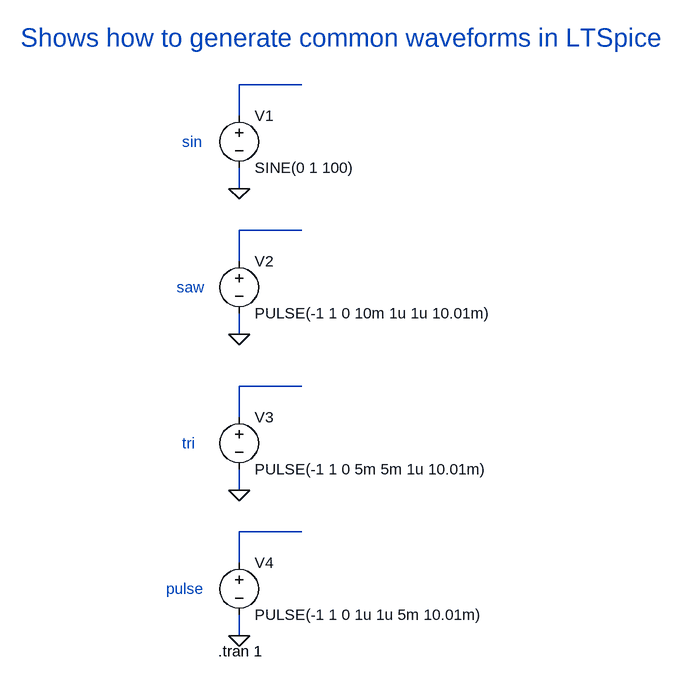
[diagram p0: schematic sin_saw_tri_pulse.asc]
sin_saw_tri_pulse.asc, the LTspice schematic file:
Version 4
SHEET 1 920 856
WIRE 288 -32 192 -32
WIRE 192 16 192 -32
WIRE 192 128 192 96
WIRE 288 192 192 192
WIRE 192 240 192 192
WIRE 192 352 192 320
WIRE 288 432 192 432
WIRE 192 480 192 432
WIRE 192 592 192 560
WIRE 288 656 192 656
WIRE 192 704 192 656
WIRE 192 816 192 784
FLAG 192 128 0
FLAG 192 352 0
FLAG 192 592 0
FLAG 192 816 0
SYMBOL voltage 192 0 R0
WINDOW 123 0 0 Left 0
WINDOW 39 0 0 Left 0
SYMATTR InstName V1
SYMATTR Value SINE(0 1 100)
SYMBOL voltage 192 224 R0
WINDOW 123 0 0 Left 0
WINDOW 39 0 0 Left 0
SYMATTR InstName V2
SYMATTR Value PULSE(-1 1 0 10m 1u 1u 10.01m)
SYMBOL voltage 192 464 R0
WINDOW 123 0 0 Left 0
WINDOW 39 0 0 Left 0
SYMATTR InstName V3
SYMATTR Value PULSE(-1 1 0 5m 5m 1u 10.01m)
SYMBOL voltage 192 688 R0
WINDOW 123 0 0 Left 0
WINDOW 39 0 0 Left 0
SYMATTR InstName V4
SYMATTR Value PULSE(-1 1 0 1u 1u 5m 10.01m)
TEXT 160 840 Left 2 !.tran 1
TEXT 104 56 Left 2 ;sin
TEXT 96 280 Left 2 ;saw
TEXT 104 520 Left 2 ;tri
TEXT 80 744 Left 2 ;pulse
TEXT -144 -104 Left 4 ;Shows how to generate common waveforms in LTSpice

The netlist it stands for:
* sin_saw_tri_pulse.asc
V1 N001 0 SINE(0 1 100)
V2 N002 0 PULSE(-1 1 0 10m 1u 1u 10.01m)
V3 N003 0 PULSE(-1 1 0 5m 5m 1u 10.01m)
V4 N004 0 PULSE(-1 1 0 1u 1u 5m 10.01m)
.tran 1
* sin
* saw
* tri
* pulse
* Shows how to generate common waveforms in LTSpice
.backanno
.end